# Altium schematic sheet 1_MLink_V13.SchDoc
size 292 x 220 mm; PageSetup: Record=PageOptions|CenterHorizontal=True|CenterVertical=True|PrintScale=0.94|XCorrection=1.00|YCorrection=1.00|PrintKind=0|BorderSize=5000000|LeftOffset=0|BottomOffset=0|Orientation=2|PaperLength=1000|PaperWidth=1000|Scale=100|PaperSource=7|PrintQuality=-4|MediaType=1|DitherType=10|PaperKind=A4 (210 x 297 mm)|PrintScaleMode=1
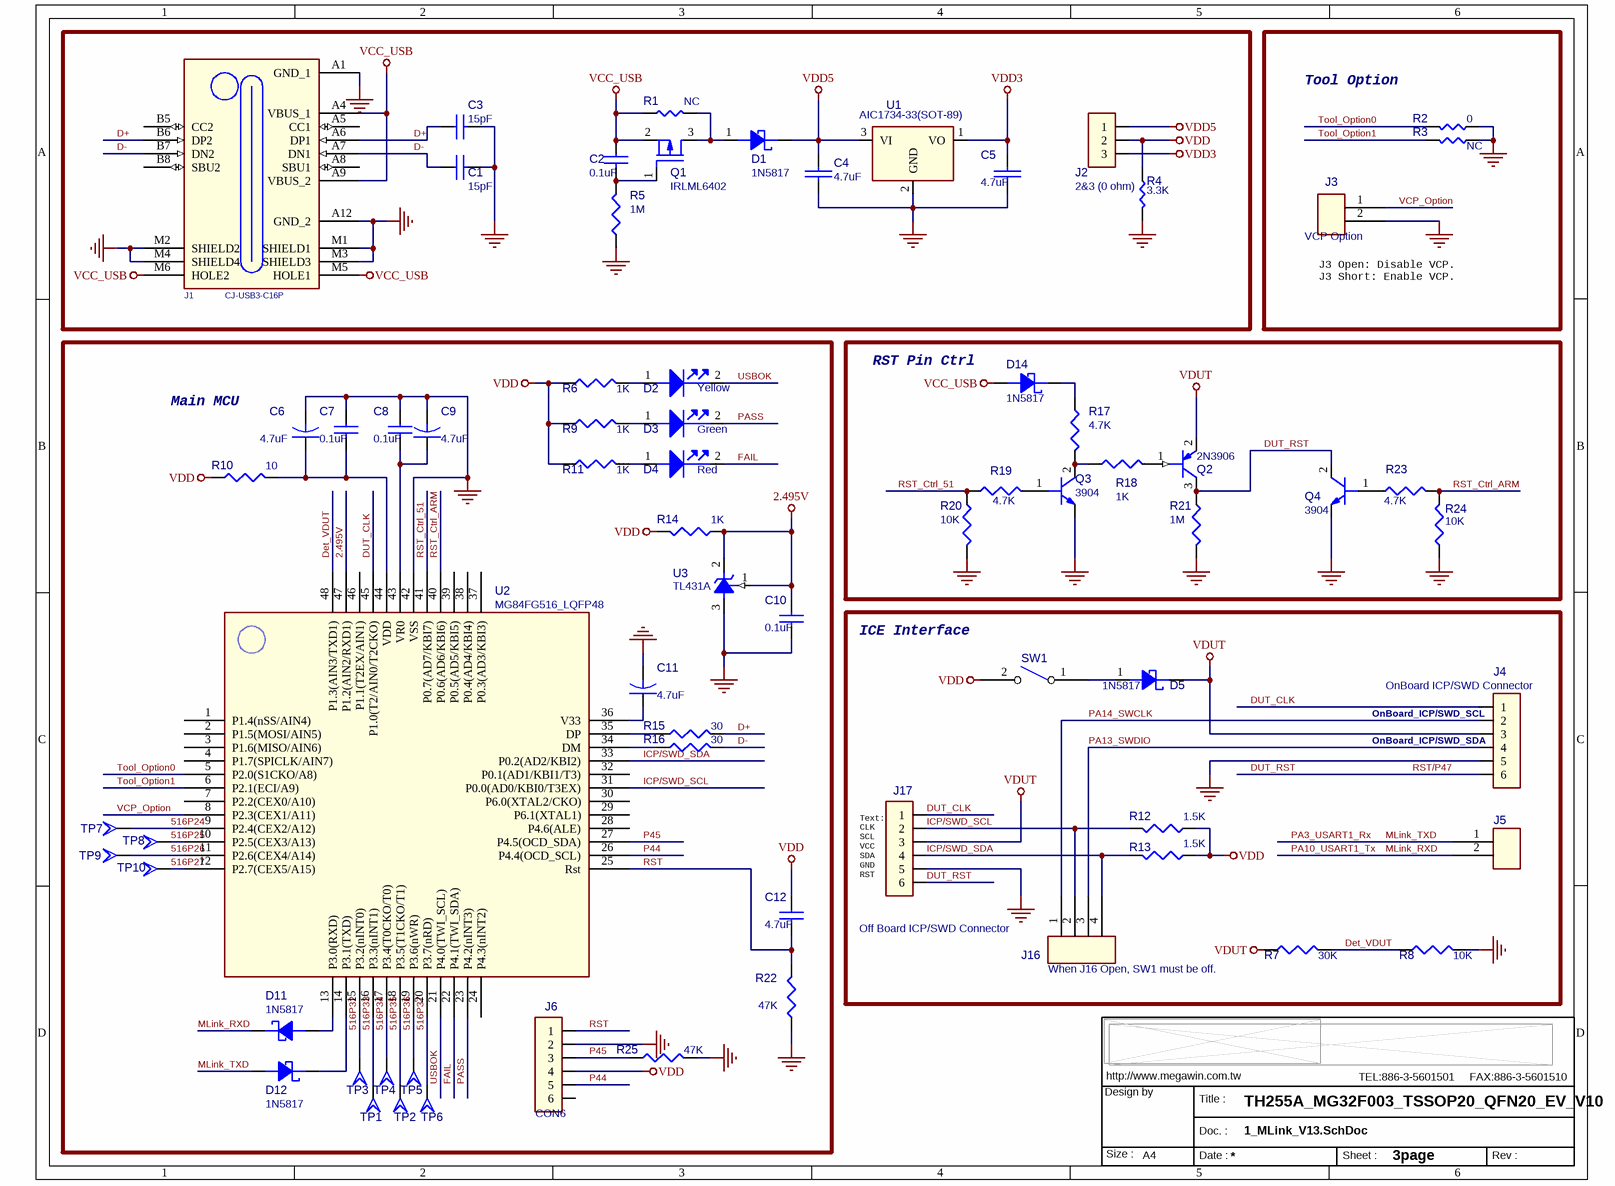
[diagram p0: 1_MLink_V13.SchDoc]

## Parts
C1  15pF  [0603C]
C2  0.1uF  [0603C]
C3  15pF  [0603C]
C4  4.7uF  [0805C]
C5  4.7uF  [0805C]
C6  4.7uF  [0805C]
C7  0.1uF  [0603C]
C8  0.1uF  [0603C]
C9  4.7uF  [0805C]
C10  0.1uF  [0603C]
C11  4.7uF  [0805C]
C12  4.7uF  [0805C]
D1  1N5817  [DIODE_SMA_SOD323]
D2  Yellow  [0805D]
D3  Green  [0805D]
D4  Red  [0805D]
D5  1N5817  [DIODE_SMA_SOD323]
D11  1N5817  [DIODE_SMA_SOD323]
D12  1N5817  [DIODE_SMA_SOD323]
D14  1N5817  [DIODE_SMA_SOD323]
J1  CJ-USB3-C16P  [USB_CF_16_SMD]
J2  2&3 (0 ohm)  [PS3P254]
J3  VCP Option  [PS2P254]
J4  OnBoard ICP/SWD Connector  [PS6P254]
J5  NC  [PS2P254]  (value not drawn)
J6  CON6  [PS6P254]
J16  When J16 Open, SW1 must be off.  [PS4P254]
J17  Off Board ICP/SWD Connector  [PS6P254_90]
MW1  OrgAddr3: TEL:886-3-5601501     FAX:886-3-5601510  [MEGAWIN_3.4_1]  (hidden comment: MW-A4)  (no BOM)
Q1  IRLML6402  [SOT23]
Q2  2N3906  [SOT23]
Q3  3904  [SOT23_132]
Q4  3904  [SOT23_132]
R1  NC  [0603R]
R2  0  [0603R]
R3  NC  [0603R]
R4  3.3K  [0603R]
R5  1M  [0603R]
R6  1K  [0603R]
R7  30K  [0603R]
R8  10K  [0603R]
R9  1K  [0603R]
R10  10  [0603R]
R11  1K  [0603R]
R12  1.5K  [0603R]
R13  1.5K  [0603R]
R14  1K  [0603R]
R15  30  [0603R]
R16  30  [0603R]
R17  4.7K  [0603R]
R18  1K  [0603R]
R19  4.7K  [0603R]
R20  10K  [0603R]
R21  1M  [0603R]
R22  47K  [0603R]
R23  4.7K  [0603R]
R24  10K  [0603R]
R25  47K  [0603R]
SW1  SW KEY-SPST  [DIP2_SW]  (value not drawn)
TP1  T POINT A  [PIN1_1H0]  (value not drawn)
TP2  T POINT A  [PIN1_1H0]  (value not drawn)
TP3  T POINT A  [PIN1_1H0]  (value not drawn)
TP4  T POINT A  [PIN1_1H0]  (value not drawn)
TP5  T POINT A  [PIN1_1H0]  (value not drawn)
TP6  T POINT A  [PIN1_1H0]  (value not drawn)
TP7  T POINT A  [PIN1_1H0]  (value not drawn)
TP8  T POINT A  [PIN1_1H0]  (value not drawn)
TP9  T POINT A  [PIN1_1H0]  (value not drawn)
TP10  T POINT A  [PIN1_1H0]  (value not drawn)
U1  AIC1734-33(SOT-89)  [SOT89]
U2  MG84FG516_LQFP48  [LQFP48_7X7_050]
U3  TL431A  [SOT23]

## Blocks framed on the sheet
Tool Option: J3 R2 R3
Main MCU: C6-C12 D2-D4 D11 D12 J6 R6 R9-R11 R14-R16 R22 R25 TP1-TP10 U2 U3
RST Pin Ctrl: D14 Q2-Q4 R17-R21 R23 R24
ICE Interface: D5 J4 J5 J16 J17 R7 R8 R12 R13 SW1

## Nets
2.495V: C10.1 R14.1 U2.47(P1.2(AIN2/RXD1)) U3.1(VREF) U3.2(C)
GND_POWER: C1.2 C3.2 C4.2 C5.2 C6.2 C7.1 C8.1 C9.2 C10.2 C11.2 J1.A1(GND_1) J1.A12(GND_2) J1.M1(SHIELD1) J1.M2(SHIELD2) J1.M3(SHIELD3) J1.M4(SHIELD4) J3.2 J4.5 J6.2 J17.5 Q3.3(E) Q4.3(E) R2.2 R3.2 R4.2 R5.1 R8.2 R20.2 R21.2 R22.1 R24.2 R25.2 U1.2(GND) U2.42(VSS) U3.3(A)
VCC_USB: C2.1 D14.1(ANODE) J1.A4(VBUS_1) J1.A9(VBUS_2) J1.M5(HOLE1) J1.M6(HOLE2) Q1.2(S) R1.1
VDD: C12.1 J2.2 J6.4 R4.1 R6.1 R9.1 R10.1 R11.1 R12.1 R13.1 R14.2 SW1.2
VDD3: C5.1 J2.3 U1.1(VO)
VDD5: C4.1 D1.2(CATHODE) J2.1 U1.3(VI)
VDUT: D5.2(CATHODE) J4.3 J17.3 Q2.2(EMITTER) R7.1
516P24: TP7.1(TP) U2.9(P2.4(CEX2/A12))
516P25: TP8.1(TP) U2.10(P2.5(CEX3/A13))
516P26: TP9.1(TP) U2.11(P2.6(CEX4/A14))
516P27: TP10.1(TP) U2.12(P2.7(CEX5/A15))
516P32: TP3.1(TP) U2.15(P3.2(nINT0))
516P33: TP1.1(TP) U2.16(P3.3(nINT1))
516P34: TP4.1(TP) U2.17(P3.4(T0CKO/T0))
516P35: TP2.1(TP) U2.18(P3.5(T1CKO/T1))
516P36: TP5.1(TP) U2.19(P3.6(nWR))
516P37: TP6.1(TP) U2.20(P3.7(nRD))
D+: C3.1 J1.A6(DP1) J1.B6(DP2) R15.2
D-: C1.1 J1.A7(DN1) J1.B7(DN2) R16.2
Det_VDUT: R7.2 R8.1 U2.48(P1.3(AIN3/TXD1))
DUT_CLK: J4.1 J17.1 U2.45(P1.0(T2/AIN0/T2CKO))
DUT_RST: J4.6 J17.6 Q2.3(COLLECTOR) Q4.2(C) R21.1  [also labelled RST/P47]
FAIL: D4.2 U2.22(P4.1(TWI_SDA))
ICP/SWD_SCL: J16.2 J17.2 R12.2 U2.31(P0.0(AD0/KBI0/T3EX))
ICP/SWD_SDA: J16.4 J17.4 R13.2 U2.33(P0.2(AD2/KBI2))
MLink_RXD: D11.2(CATHODE) J5.2  [also labelled PA10_USART1_Tx]
MLink_TXD: D12.1(ANODE) J5.1  [also labelled PA3_USART1_Rx]
P44: J6.5 U2.26(P4.4(OCD_SCL))
P45: J6.3 R25.1 U2.27(P4.5(OCD_SDA))
PA13_SWDIO: J4.4 J16.3
PA14_SWCLK: J4.2 J16.1
PASS: D3.2 U2.23(P4.2(nINT3))
RST: C12.2 J6.1 R22.2 U2.25(Rst)
RST_Ctrl_51: R19.1 R20.1 U2.41(P0.7(AD7/KBI7))
RST_Ctrl_ARM: R23.1 R24.1 U2.40(P0.6(AD6/KBI6))
Tool_Option0: R2.1 U2.5(P2.0(S1CKO/A8))
Tool_Option1: R3.1 U2.6(P2.1(ECI/A9))
USBOK: D2.2 U2.21(P4.0(TWI_SCL))
VCP_Option: J3.1 U2.8(P2.3(CEX1/A11))
NetC2_2: C2.2 Q1.1(G) R5.2
NetC6_1: C6.1 C7.2 R10.2 U2.44(VDD)
NetC8_2: C8.2 C9.1 U2.43(VR0)
NetC11_1: C11.1 U2.36(V33)
NetD1_1: D1.1(ANODE) Q1.3(D) R1.2
NetD2_1: D2.1 R6.2
NetD3_1: D3.1 R9.2
NetD4_1: D4.1 R11.2
NetD5_1: D5.1(ANODE) SW1.1
NetD11_1: D11.1(ANODE) U2.13(P3.0(RXD))
NetD12_2: D12.2(CATHODE) U2.14(P3.1(TXD))
NetD14_2: D14.2(CATHODE) R17.1
NetQ2_1: Q2.1(BASE) R18.2
NetQ3_1: Q3.1(B) R19.2
NetQ3_2: Q3.2(C) R17.2 R18.1
NetQ4_1: Q4.1(B) R23.2
NetR15_1: R15.1 U2.35(DP)
NetR16_1: R16.1 U2.34(DM)

Not connected (* = marked no-connect by the designer): J1 A5(CC1) A8(SBU1) B5(CC2) B8(SBU2); J6 6; U2 1(P1.4(nSS/AIN4)) 2(P1.5(MOSI/AIN5)) 3(P1.6(MISO/AIN6)) 4(P1.7(SPICLK/AIN7)) 7(P2.2(CEX0/A10)) 24(P4.3(nINT2)) 28(P4.6(ALE)) 29(P6.1(XTAL1)) 30(P6.0(XTAL2/CKO)) 32(P0.1(AD1/KBI1/T3)) 37(P0.3(AD3/KBI3)) 38(P0.4(AD4/KBI4)) 39(P0.5(AD5/KBI5)) 46(P1.1(T2EX/AIN1))

## Notes on the sheet
- (near J3) J3 Open: Disable VCP.
  J3 Short: Enable VCP.
- (near J4) OnBoard_ICP/SWD_SCL
- (near J4) OnBoard_ICP/SWD_SDA
- (near J17) Text:
  CLK
  SCL
  VCC
  SDA
  GND
  RST
- TH255A_MG32F003_TSSOP20_QFN20_EV_V10
- 3page
- (in symbol MW_A4_2) Design by; Title :; Doc. :; Size :; A4; Date :; Sheet :; Rev :

## Library data of the parts
C1 C3 C7 C12 = CAP NP_Dup1
C2 C8 C10 = CAP NP
C4 C5 = C NP
C6 C9 C11 = CAP
D1 D5 D11 D12 D14 = DIODE SCHOTTKY
D2-D4 = Led0_0
J1 = CJ-USB3-C16P: TPYE-C-9; Name: Type-c
J2 = CON3
J3 J5 = CON2
J4 J17 = CON6
J16 = CON4
MW1 = MW_A4_2: Page Create Date: March  8, 1995; OrgAddr2: http://www.megawin.com.tw
Q1 = MOSFET P GSD
Q2 = 2N3906_0
Q3 Q4 = NPN BCE
R1-R4 = R_Dup4
R5-R9 R11-R13 R17-R19 R22 R23 R25 = R_Dup2
R10 R14-R16 = R_Dup5
R20 R21 R24 = R_Dup1
U1 = AIC1722-33
U3 = TL431/CYL